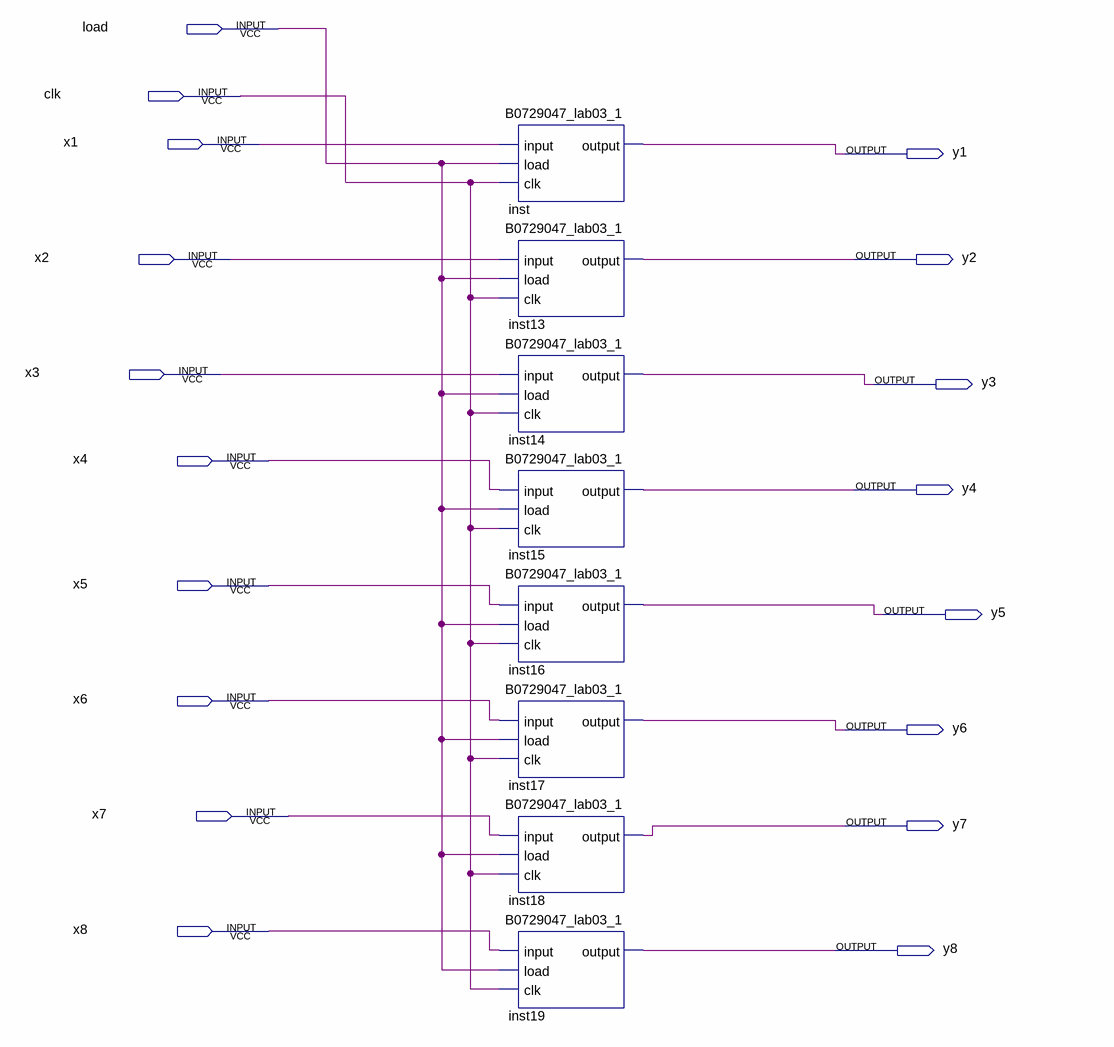
[diagram p0: schematic sheet]
// Quartus schematic B0729047_lab03_2.bdf as structural Verilog: 8 symbols, 18 pins
module B0729047_lab03_2 (
  input  load,
  input  clk,
  input  x1,
  input  x2,
  input  x3,
  input  x4,
  input  x5,
  input  x6,
  input  x7,
  input  x8,
  output y1,
  output y2,
  output y3,
  output y4,
  output y5,
  output y6,
  output y7,
  output y8
);

  B0729047_lab03_1 inst (.\input (x1), .load(load), .clk(clk), .\output (y1));
  B0729047_lab03_1 inst13 (.\input (x2), .load(load), .clk(clk), .\output (y2));
  B0729047_lab03_1 inst14 (.\input (x3), .load(load), .clk(clk), .\output (y3));
  B0729047_lab03_1 inst15 (.\input (x4), .load(load), .clk(clk), .\output (y4));
  B0729047_lab03_1 inst16 (.\input (x5), .load(load), .clk(clk), .\output (y5));
  B0729047_lab03_1 inst17 (.\input (x6), .load(load), .clk(clk), .\output (y6));
  B0729047_lab03_1 inst18 (.\input (x7), .load(load), .clk(clk), .\output (y7));
  B0729047_lab03_1 inst19 (.\input (x8), .load(load), .clk(clk), .\output (y8));
endmodule
